# EAGLE design 180V_StepUp (EAGLE 9.5.1)

## Sheet 1 of 3
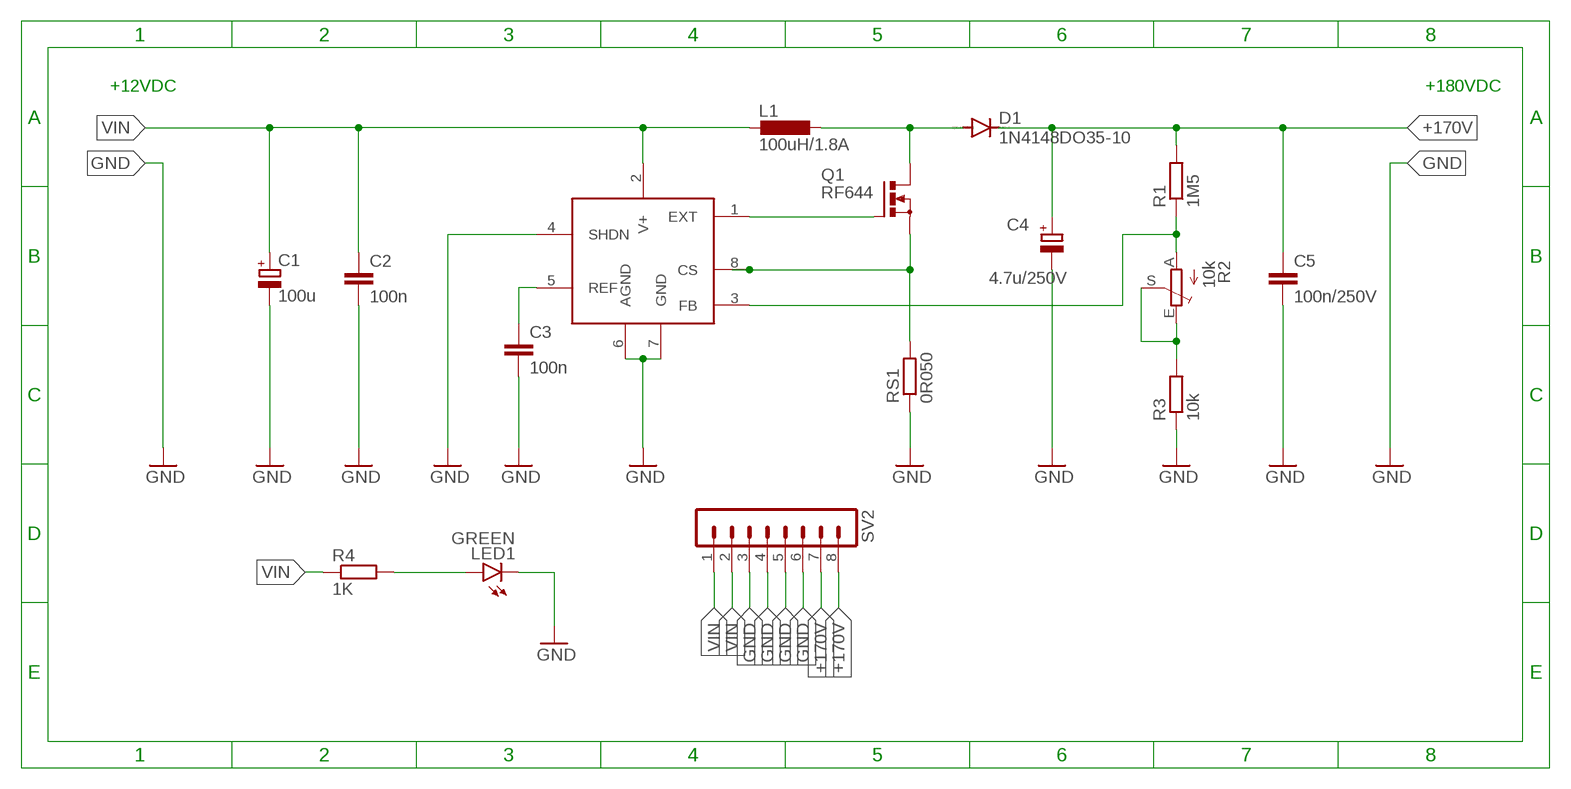
[diagram p0: schematic, sheet 1]

### Parts
C1  100u  CPOL-EUE2.5-7  [E2,5-7]
C2  100n  C-EUC0805  [C0805]
C3  100n  C-EUC0805  [C0805]
C4  4.7u/250V  CPOL-EUE2.5-7  [E2,5-7]
C5  100n/250V  C-EUC2225K  [C2225K]
D1  1N4148DO35-10  [DO35-10]
IC1  MAX1771  [SO08]
L1  100uH/1.8A  DO3316P  [DO3316P]
LED1  GREEN  LED_1206SMT1206  [1206]
Q1  RF644  PMOSFET_NTO220BV  [TO220BV]
R1  1M5  R-EU_R0805  [R0805]
R2  10k  TRIM_EU-RJ9W  [RJ9W]
R3  10k  R-EU_R0805  [R0805]
R4  1K  R-EU_1206R1206  [R1206]
RS1  0R050  R-EU_0207/10  [0207/10]
SV2  MA08-1  [MA08-1]

### Nets
+170V: C4.+ C5.1 D1.C R1.2 SV2.7 SV2.8
GND: C1.- C2.2 C3.2 C4.- C5.2 IC1.4(SHDN) IC1.6(AGND) IC1.7(GND) LED1.C R3.1 RS1.1 SV2.3 SV2.4 SV2.5 SV2.6
N$1: LED1.A R4.2
N$2: D1.A L1.2 Q1.D
N$3: C3.1 IC1.5(REF)
N$4: IC1.1(EXT) Q1.G
N$5: IC1.8(CS) Q1.S RS1.2
N$6: IC1.3(FB) R1.1 R2.A
N$7: R2.E R2.S R3.2
VIN: C1.+ C2.1 IC1.2(V+) L1.1 R4.1 SV2.1 SV2.2

### Notes on the sheet
- +12VDC | +180VDC

## Sheet 2 of 3
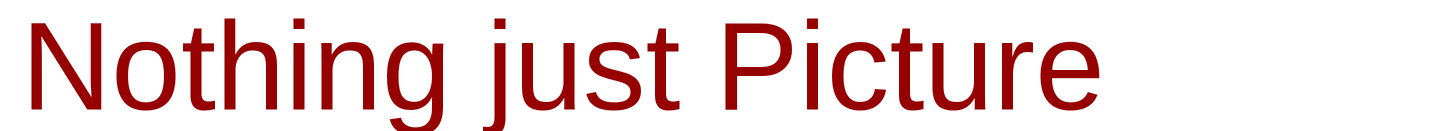
[diagram p1: schematic, sheet 2]

### Notes on the sheet
- Nothing just Picture

## Sheet 3 of 3

## Library data of the parts
C1 C4 = rcl:CPOL-EU: POLARIZED CAPACITOR, European symbol; SPICEPREFIX: C
C2 C3 C5 = rcl:C-EU: CAPACITOR, European symbol; SPICEPREFIX: C
D1 = diode:1N4148: DIODE high speed (Philips)
IC1 = nixie_clock:MAX1771
L1 = nixie_clock:DO3316P: COILCRAFT; OC_FARNELL: unknown; OC_NEWARK: unknown
LED1 = CommonParts:LED_1206: LED OSRAM: - CHIPLED LG R971, LG N971, LY N971, LG Q971, LY Q971, LO R971, LY R971 LH N974, LH R974 LS Q976, LO Q976, LY Q976 LO Q996 - Hyper CHIPLED LW Q18S LB Q993, LB Q99A, LB R99A - SideLED LS A670, LO A670, LY A670, LG A670, LP A670 LB A673, LV A673, LT A673, LW A673 LH A674 LY A675 LS A676, LA A676, LO A676, LY A676, LW A676 LS A679, LY A679, LG A679 - Hyper Micro SIDELED® LS Y876, LA Y876, LO Y876, LY Y876 LT Y87S - SmartLED LW L88C, LW L88S LB L89C, LB L89S, LG L890 LS L89K, LO L89K, LY L89K LS L896, LA L896, LO L896, LY L896 - TOPLED LS T670, LO T670, LY T670, LG T670, LP T670 LSG T670, LSP T670, LSY T670, LOP T670, LYG T670 LG T671, LOG T671, LSG T671 LB T673, LV T673, LT T673, LW T673 LH T674 LS T676, LA T676, LO T676, LY T676, LB T676, LH T676, LSB T676, LW T676 LB T67C, LV T67C, LT T67C, LS T67K, LO T67K, LY T67K, LW E67C LS E67B, LA E67B, LO E67B, LY E67B, LB E67C, LV E67C, LT E67C LW T67C LS T679, LY T679, LG T679 LS T770, LO T770, LY T770, LG T770, LP T770 LB T773, LV T773, LT T773, LW T773 LH T774 LS E675, LA E675, LY E675, LS T675 LS T776, LA T776, LO T776, LY T776, LB T776 LHGB T686 LT T68C, LB T68C - Hyper Mini TOPLED® LB M676 - Mini TOPLED Santana® LG M470 LS M47K, LO M47K, LY M47K Source: http://www.osram.convergy.de LUXEON: - LUMILED® LXK2-PW12-R00, LXK2-PW12-S00, LXK2-PW14-U00, LXK2-PW14-V00 LXK2-PM12-R00, LXK2-PM12-S00, LXK2-PM14-U00 LXK2-PE12-Q00, LXK2-PE12-R00, LXK2-PE12-S00, LXK2-PE14-T00, LXK2-PE14-U00 LXK2-PB12-K00, LXK2-PB12-L00, LXK2-PB12-M00, LXK2-PB14-N00, LXK2-PB14-P00, LXK2-PB14-Q00 LXK2-PR12-L00, LXK2-PR12-M00, LXK2-PR14-Q00, LXK2-PR14-R00 LXK2-PD12-Q00, LXK2-PD12-R00, LXK2-PD12-S00 LXK2-PH12-R00, LXK2-PH12-S00 LXK2-PL12-P00, LXK2-PL12-Q00, LXK2-PL12-R00 Source: www.luxeon.com KINGBRIGHT: KA-3528ASYC Source: www.kingbright.com
Q1 = transistor-power:PMOSFET_N: Power MOSFET N-Channel
R1 R3 RS1 = rcl:R-EU_: RESISTOR, European symbol; SPICEPREFIX: R
R2 = pot:TRIM_EU-: POTENTIOMETER
R4 = CommonParts:R-EU_1206: RESISTOR, European symbol
SV2 = con-lstb:MA08-1: PIN HEADER; OC_FARNELL: unknown; OC_NEWARK: unknown

## Board
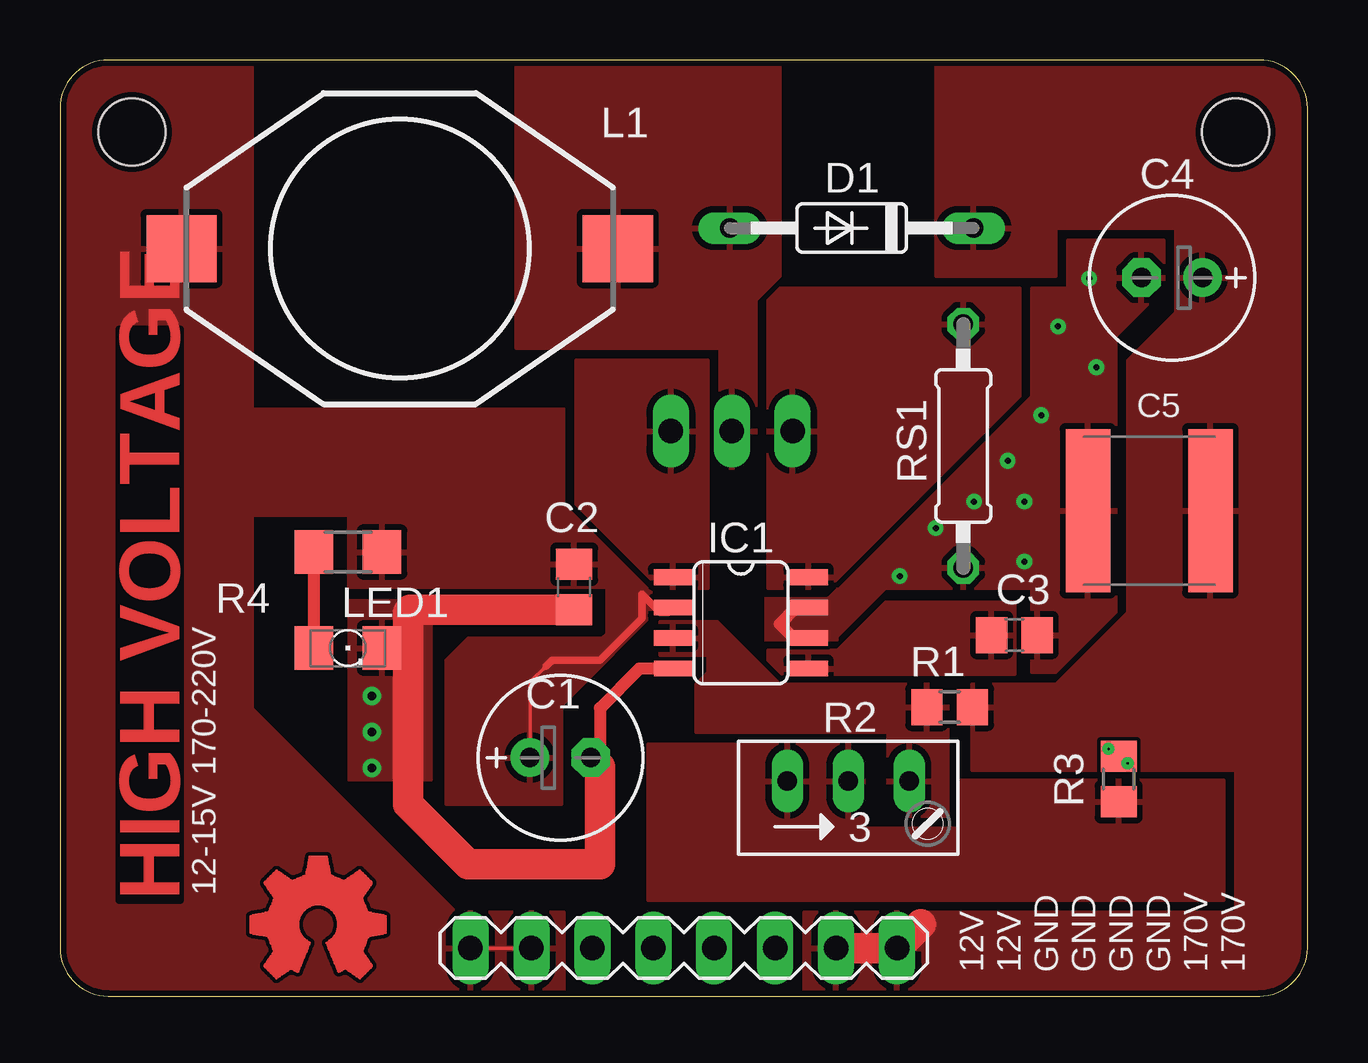
[diagram p2: board, top side]
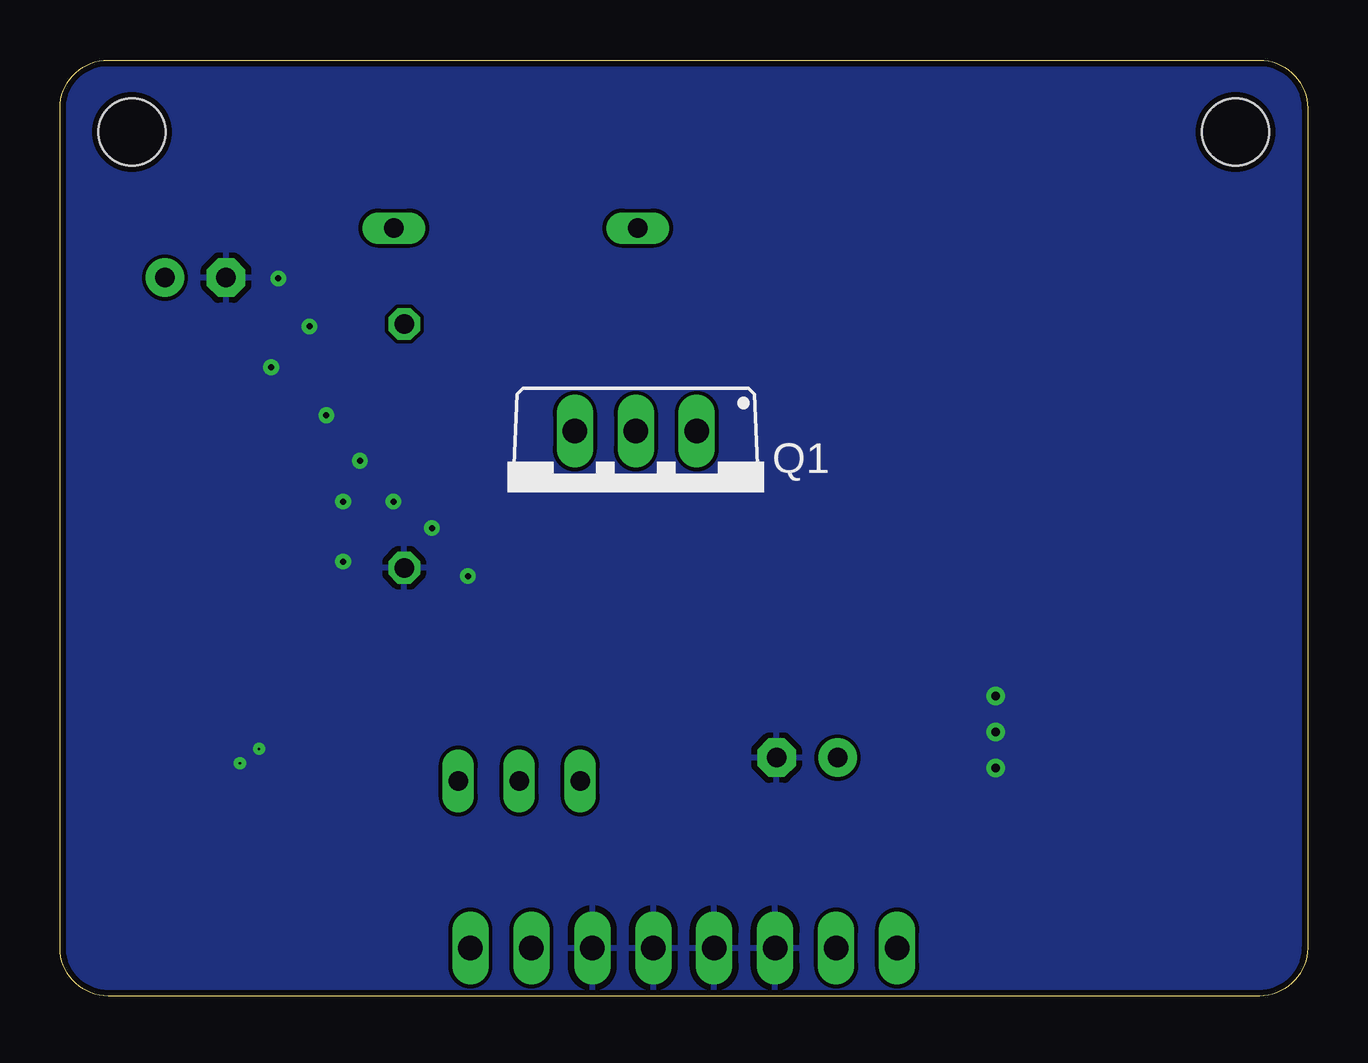
[diagram p3: board, bottom side, seen from below]

Size 52 x 39 mm. Coordinates in mm from the lower left corner, seen from the top.
Outline: 52,2 52,37 arc90 50,39 2,39 arc90 0,37 0,2 arc90 2,0 50,0 arc90 52,2
Copper layers (1*16): Top 0.035mm / dielectric 1.5mm / Bottom 0.035mm
Design rules "default *": minimum track width 6mil, minimum drill 0.35mm, track to track 6mil, track to pad 6mil, pad to pad 6mil, via to via 6mil, smd to smd 6mil, copper to edge 10mil, drill to drill 6mil, minimum pad ring 10mil, minimum via ring 8mil, stop-mask expansion 4mil, vias tented up to drill 0mil, thermal gap 10mil
Holes 2.8 mm at 3,36 49,36
bKeepout: area 22,4 to 34,22

### Footprints (pad centres in the part's own frame; a part is rotated, then mirrored left to right if it is on the bottom)
E2,5-7 = drill 0.813 pad 1.6: + -1.27,0 | drill 0.813 pad 1.6 octagon: - 1.27,0
C0805 = smd 1.3 x 1.5: 1 -0.95,0; 2 0.95,0
C2225K = smd 1.85 x 6.8: 1 -2.55,0; 2 2.55,0
DO35-10 = drill 0.813 long: A 5.08,0; C -5.08,0
SO08 = smd 0.66 x 1.6: 1 -1.905,-2.823; 2 -0.635,-2.823; 3 0.635,-2.823; 4 1.905,-2.823; 5 1.905,2.823; 6 0.635,2.823; 7 -0.635,2.823; 8 -1.905,2.823
DO3316P = smd 2.92 x 2.79: 1 -9.09,0; 2 9.09,0
1206 = smd 1.6 x 1.803: A -1.422,0; C 1.422,0
TO220BV = drill 1.016 long: D 0,-2.54; G -2.54,-2.54; S 2.54,-2.54
R0805 = smd 1.3 x 1.5: 1 -0.95,0; 2 0.95,0
RJ9W = drill 0.813 long: A 2.54,0.635; E -2.54,0.635; S 0,0.635
R1206 = smd 1.6 x 1.803: 1 -1.422,0; 2 1.422,0
0207/10 = drill 0.813 octagon: 1 -5.08,0; 2 5.08,0
MA08-1 = drill 1.016 long: 1 -8.89,0; 2 -6.35,0; 3 -3.81,0; 4 -1.27,0; 5 1.27,0; 6 3.81,0; 7 6.35,0; 8 8.89,0

### Placement (x,y rotation side)
C1  20.86,9.93 0 top
C2  21.43,17.04 270 top
C3  39.78,15.04 0 top
C4  46.35,29.93 180 top
C5  45.4,20.22 180 top
D1  33,32 180 top
IC1  28.38,15.55 270 top
L1  14.16,31.14 0 top
LED1  12,14.5 0 top
Q1  28,21 180 bottom
R1  37.08,12.04 0 top
R2  32.86,8.32 0 top
R3  44.13,9.04 270 top
R4  12,18.5 180 top
RS1  37.65,22.92 90 top
SV2  26,2 0 top

### Tracks (layer width: path | path; a pad name or v marks a point on that pad's centre or on a via)
+170V
  Top 1.27: SV2.7 SV2.8 35.89,3
  pour Top: 52,9.4 38,9.4 38,13 41.5,13 44.5,16 44.5,26.5 46.5,28.5 46.5,32 41.5,32 41.5,30 36.5,30 36.5,39 50,39 arc-90 52,37
  pour Top: 52,10.4 52,2 arc-90 50,0 31,0 31,3.5 49,3.5 49,10.4
GND  (via drill 0.1, 0.25, 0.35)
  Top 0.152: R3.1 44.01,9.99 v43.7,10.3
  Top 0.508: IC1.4 24.14,13.64 22.5,12 22.5,9.56 | IC1.6 30.59,14.91 30,15.5 30.68,16.18 IC1.7
  Top 1.27: C2.2 14.59,16.09 14.5,16 14.5,8 17,5.5 22.5,5.5 22.5,9.56 C1.-
  other vias: 35,17.5 36.5,19.5 40.2,20.6 40.2,18.1 38.1,20.6 39.5,22.3 42.9,29.9 43.2,26.2 41.6,27.9 40.9,24.2 13,11 13,9.5 13,12.5 44.5,9.7
  pour Top: 29.5,16.5 29.5,15 32.4,15 34.4,17 40.5,17 40.5,13.5 41.5,13.5 44,16 44,27.5 46,29.5 46,31.5 42,31.5 42,29.5 40.5,29.5 40.5,25 32,16.5
  pour Top: 12,16.5 12,9 15.5,9 15.5,16.5
  pour Top (no thermals): 29.4,16.6 32,16.6 32.4,17 32.4,14.8 29.4,14.8
  pour Bottom: 52,38 52,0 1,0 arc-90 0,1 0,37 arc-90 2,39 51,39 arc-90
  pour Bottom: 51.95,37.05 51.95,1.95 arc-90 50,0 2,0 arc-90 0,2 0,37 arc-90 2,39 50,39 arc-90
N$1
  Top 0.508: R4.2 LED1.A
N$2
  pour Top: 29,22 29,29 30,30 30,39 19,39 19,27 27.5,27 27.5,22
N$3
  pour Top: 29.5,14.4 32.4,14.4 34.4,16.4 39.8,16.4 39.8,13.4 30.1,13.4 29.5,14
N$4
  pour Top: 27,17 27,26.5 21.5,26.5 21.5,20.5 25,17
N$5
  pour Top: 32,17 29.5,17 29.5,29 30,29.5 40,29.5 40,25
N$6
  pour Top: 25,15.6 27.4,15.6 30,13 37,13 37,7.5 34.5,7.5 34.5,11 26.5,11 26.5,13 27,13.5 27,14.2 25,14.2
N$7
  pour Top: 24.5,10.5 33.5,10.5 33.5,7 37.5,7 37.5,9 48.5,9 48.5,4 24.5,4
VIN
  Top 0.152: 4.5,30.57 L1.1 | SV2.2 SV2.1 | C1.+ 19.59,13.09 20.25,13.75
  Top 0.305: IC1.2 25.37,16 25,16 24.25,16.75 24.25,15.75 22.5,14 20.5,14 20.25,13.75
  pour Top: 25.26,16.46 20.9,12.1 20.9,8 16.1,8 16.1,14 17,14.9 22.6,14.9 22.8,15.1 22.8,17.88
  pour Top: 21,0 21,3.5 16.5,3.5 8,12 8,39 2,39 arc90 0,37 0,2 arc90 2,0
  pour Top: 24.5,17 12,17 12,20 7.5,20 7.5,24.5 21,24.5 21,20.5
(copper drawn outside any net)
  shapes: Top area x369

### Text on the board
Top: HIGH VOLTAGE
tNames: 12-15V 170-220V | 12V | 12V | GND | GND | GND | GND | 170V | 170V
tStop: HIGH VOLTAGE